# Altium schematic sheet Termination,connector.SchDoc: AA Design Challenge
size 431 x 279 mm; Revision: 1.0; SheetNumber: 2; SheetTotal: 4; ProjectName: TRK_GPRS_GNSS_BTLE
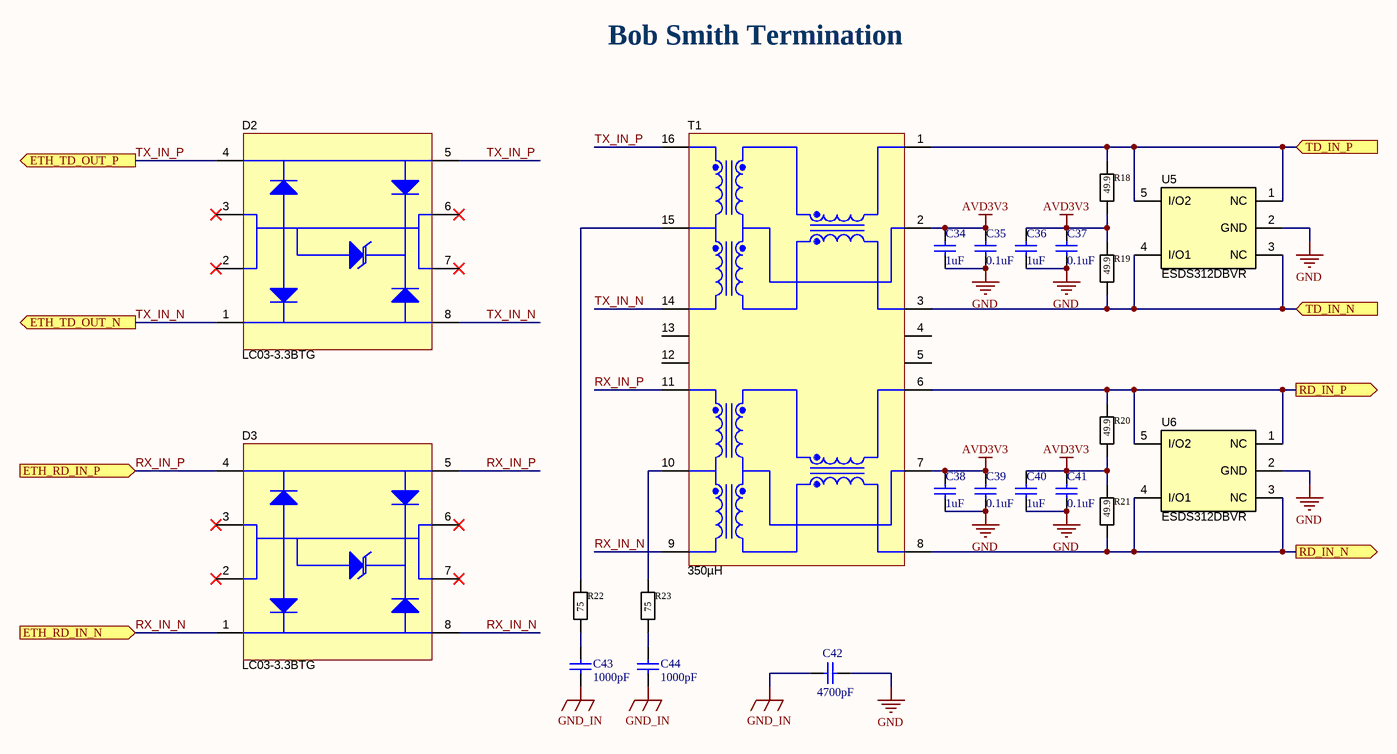
[diagram p0: Termination,connector.SchDoc]

## Parts
C34  1uF  [CAPC1005X61USR]
C35  0.1uF  [CAPC1005X61USR]
C36  1uF  [CAPC1005X61USR]
C37  0.1uF  [CAPC1005X61USR]
C38  1uF  [CAPC1005X61USR]
C39  0.1uF  [CAPC1005X61USR]
C40  1uF  [CAPC1005X61USR]
C41  0.1uF  [CAPC1005X61USR]
C42  4700pF  [CAPC4532X200N]
C43  1000pF  [CAPC1005X61USR]
C44  1000pF  [CAPC1005X61USR]
D2  LC03-3.3BTG  [SOIC127P600X175-8N]
D3  LC03-3.3BTG  [SOIC127P600X175-8N]
R18  49.9  [RESC1005X40USR]
R19  49.9  [RESC1005X40USR]
R20  49.9  [RESC1005X40USR]
R21  49.9  [RESC1005X40USR]
R22  75  [RESC1005X40USR]
R23  75  [RESC1005X40USR]
T1  ValueDisplayed: 350µH  [HX1198FNLT_PUL]
U5  ESDS312DBVR  [SOT23-5]
U6  ESDS312DBVR  [SOT23-5]

## Ports
ETH_RD_IN_N (in), ETH_RD_IN_P (in), ETH_TD_OUT_N (out), ETH_TD_OUT_P (out), RD_IN_N (out), RD_IN_P (out), TD_IN_N (in), TD_IN_P (in)

## Nets
AVD3V3: C34.2 C35.1 C36.2 C37.1 C38.2 C39.1 C40.2 C41.1 R18.2 R19.1 R20.2 R21.1 T1.2(TCT) T1.7(RCT)
GND: C34.1 C35.2 C36.1 C37.2 C38.1 C39.2 C40.1 C41.2 C42.1 U5.2(GND) U6.2(GND)
GND_IN: C42.2 C43.1 C44.1
RD_IN_N: R21.2 T1.8(RD-) U6.3(NC) U6.4(I/O1) ; port RD_IN_N
RD_IN_P: R20.1 T1.6(RD+) U6.1(NC) U6.5(I/O2) ; port RD_IN_P
RX_IN_N: D3.1 D3.8 T1.9(RX-) ; port ETH_RD_IN_N
RX_IN_P: D3.4 D3.5 T1.11(RX+) ; port ETH_RD_IN_P
TD_IN_N: R19.2 T1.3(TD-) U5.3(NC) U5.4(I/O1) ; port TD_IN_N
TD_IN_P: R18.1 T1.1(TD+) U5.1(NC) U5.5(I/O2) ; port TD_IN_P
TX_IN_N: D2.1 D2.8 T1.14(TX-) ; port ETH_TD_OUT_N
TX_IN_P: D2.4 D2.5 T1.16(TX+) ; port ETH_TD_OUT_P
NetC43_2: C43.2 R22.2
NetC44_2: C44.2 R23.2
NetR22_1: R22.1 T1.15(CMT)
NetR23_1: R23.1 T1.10(CMT)

Not connected (* = marked no-connect by the designer): D2 2* 3* 6* 7*; D3 2* 3* 6* 7*; T1 4(NC) 5(NC) 12(NC) 13(NC)

## Notes on the sheet
- Bob Smith Termination
- DWG. NO.
- REV.
- SHT.
- THIS DOCUMENT AND THE DATA DISCLOSED HEREIN OR HEREWITH IS THE PROPERTY OF ALTIUM LIMITED AND MAY BE FREELY DISTRIBUTED IN WHOLE. NO RIGHTS ARE RESERVED OR EXPRESS OR IMPLIED WARANTEE GIVEN.
- REVISION
- DESCRIPTION
- DATE
- APPROVED
- ENG:
- APPROVALS
- PROJECT
- DSN:
- CHK:
- REFERENCE DOCUMENTS
- PROJECT REVISION:
- TITLE
- DOCUMENT REVISION:
- DESIGN ITEM:
- BOM:
- FAB DWG:
- PCB DWG:
- ASSY DWG:
- SCALE:
- SIZE
- B
- CAGE CODE
- FILE NAME
- DWG NO.
- SHEET
- OF
- REV

## Library data of the parts
C34 C36 C38 C40 = Cap: CAP CER 1UF 16V X5R 0402; Manufacturer: Samsung Electro-Mechanics; Manufacturer Part Number: CL05A105KO5NNNC; Supplier Part Number 1: 1276-1067-2-ND; Supplier Part Number 2: *; Supplier 1: *; Supplier 2: *; 100pc cost: *; 1pc cost: *; Height: *; value: 1uF
C35 C37 C39 C41 = Cap: CAP CER 0.1UF 50V X7R 0402; Manufacturer: TDK Corporation; Manufacturer Part Number: CGA2B3X7R1H104K050BB; Supplier Part Number 1: 445-6899-2-ND; Supplier Part Number 2: *; Supplier 1: *; Supplier 2: *; 100pc cost: *; 1pc cost: *; Height: *; value: 0.1uF
C42 = Cap: CAP CER 4700PF 2KV X7R 1812; Manufacturer: Murata Electronics; Manufacturer Part Number: GR443DR73D472KW01L; Supplier Part Number 1: 490-6106-1-ND; value: 4700pF
C43 C44 = Cap: CAP CER 1000PF 25V X7R 0402; Manufacturer: KEMET; Manufacturer Part Number: C0402C102K3RACTU; Supplier Part Number 1: 399-1031-2-ND; Supplier Part Number 2: *; Supplier 1: *; Supplier 2: *; 100pc cost: *; 1pc cost: *; Height: *; value: 1000pF
D2 D3 = CMP-0085616-1: Diode, TVS, Uni, 3.3 V, 17 Vc, 3300 W, 150 A, SOIC-8; Manufacturer: Littelfuse; Vc: 17V; SizeZ_mm: 1.75; SizeY_mm: 4.9; SizeX_mm: 5.99; AEC Qualified: N; Value: 3.3V; SizeArea_mm2: 29.351; Ipp: 150A; SizeAreaWB_mm2: 55.131; AEC Category: Q101; Ppk: 3.3kW; CompType: TVS; RoHS: Y; Manufacturer Part Number: LC03-3.3BTG; ComponentLink1Description: Datasheet link; Value1: 17V; MountType: SMT; PackageReference: SOIC-8; ComponentLink1URL: https://www.littelfuse.com/~/media/electronics/datasheets/tvs_diode_arrays/littelfuse_tvs_diode_array_lc03_3_3_datasheet.pdf.pdf; VRWM: 3.3V
R18-R21 = R: RES SMD 49.9 OHM 1% 1/16W 0402; Manufacturer: Yageo; Manufacturer Part Number: RC0402FR-0749R9L; Power Rating: 62.5mW; Tolerance: +/-1%; Voltage Rating: NA; Distributor: DigiKey; Value: 49.9; Distributor Art. Nbr.: 311-49.9LRTR-ND; Package: EIA-0402; Price Estim. @ 100pcs: 0.0049; Height: 0.40mm
R22 R23 = R: RES SMD 75 OHM 1% 1/10W 0402; Manufacturer: Panasonic Electronic Components; Manufacturer Part Number: ERJ-2RKF75R0X; Power Rating: 62.5mW; Tolerance: +/-1%; Voltage Rating: NA; Distributor: DigiKey; Value: 75; Distributor Art. Nbr.: P75.0LTR-ND; Package: EIA-0402; Price Estim. @ 100pcs: 0.0049; Height: 0.40mm
T1 = HX1198FNLT: Transformer, 350 uH, SMT; Manufacturer: Pulse Engineering; SymbolCreator: Altium; Value: 350uH; Lp: 350; Ind_H: 0.00035; Green_Lifecycle: Not Set; Green_REACh: Incomplete; SymbolVersion: 2015-05-04; Manufacturer Part Number: HX1198FNLT; MountType: SMT; PackageReference: 12.7x9.09mm; RoHS: Y; ComponentLink1URL: http://productfinder.pulseeng.com/products/datasheets/HX1198FNL.pdf;jsessionid=741BCD40859F1B611B313F549D3EF800; ComponentLink1Description: Datasheet URL; CompType: Transformer; Publisher: Texas Instruments; LatestRevisionDate: 2017-06-21; Supplier 1: Digi-Key; Supplier Part Number 1: 553-2209-1-ND; Supplier 2: Mouser; Supplier Part Number 2: 673-HX1198FNLT; Green_EU RoHS: Incomplete; Green_EU RoHS-2: Incomplete
U5 U6 = ESDS312DBVR: FAMILY OF UNI-DIRECTIONAL SURGE; Alternate Manufacturer: Texas Instruments; SizeX_mm: 2.8; SizeArea_mm2: 8.12; Rating: Catalog; SizeAreaWB_mm2: 14.82; AEC Category: Q200; AEC Qualified: N; CompType: IC; SizeZ_mm: 1.45; SizeY_mm: 2.9; ComponentLink3URL: http://www.ti.com/product/esds312/datasheet; PackageDescription: SOT-23-5; RoHS: Y; ComponentLink1Description: Datasheet Link; Operating Temperature Range: -40 to 125 C; PackageReference: DBV0005A; Digi-Key Part Number: 296-51112-2-ND; ComponentLink1URL: http://www.ti.com/lit/ds/symlink/esds312.pdf; ComponentLink3Description: Online Datasheet; MountType: SMT; ComponentLink2URL: http://www.ti.com/product/esds312; Manufacturer: Texas Instruments; ComponentLink2Description: Product Folder; Manufacturer Part Number: ESDS312DBVR